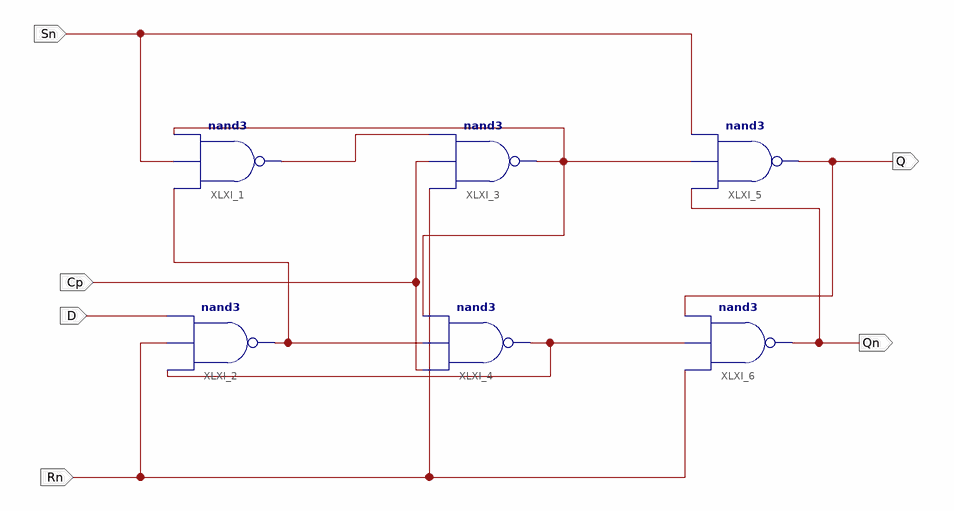
[diagram p0: schematic sheet 1]
// Xilinx ISE schematic MB_DFF.sch (kintex7) as structural Verilog: 6 symbols, 6 ports
module MB_DFF (
  input  Cp,
  input  Sn,
  input  Rn,
  input  D,
  output Qn,
  output Q
);

  wire XLXN_1, XLXN_3, XLXN_7, XLXN_12;

  nand XLXI_1 (XLXN_1, XLXN_7, Sn, XLXN_3);
  nand XLXI_2 (XLXN_7, XLXN_12, Rn, D);
  nand XLXI_3 (XLXN_3, Rn, Cp, XLXN_1);
  nand XLXI_4 (XLXN_12, Cp, XLXN_7, XLXN_3);
  nand XLXI_5 (Q, Qn, XLXN_3, Sn);
  nand XLXI_6 (Qn, Rn, XLXN_12, Q);
endmodule
